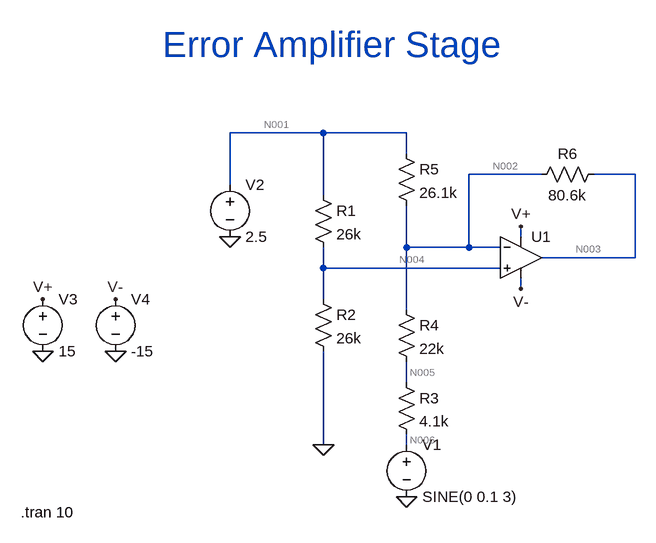
[diagram p0: schematic Error Amplifier Stage.asc]
Error Amplifier Stage.asc, the LTspice schematic file:
Version 4
SHEET 1 1000 680
WIRE -96 -16 -240 -16
WIRE 32 -16 -96 -16
WIRE 32 16 32 -16
WIRE 240 48 128 48
WIRE 384 48 320 48
WIRE -240 64 -240 -16
WIRE -96 80 -96 -16
WIRE 208 144 208 128
WIRE 32 160 32 96
WIRE 128 160 128 48
WIRE 128 160 32 160
WIRE 176 160 128 160
WIRE 384 176 384 48
WIRE 384 176 240 176
WIRE -96 192 -96 160
WIRE 176 192 -96 192
WIRE 208 224 208 208
WIRE -96 240 -96 192
WIRE 32 256 32 160
WIRE 32 368 32 336
WIRE -96 464 -96 320
WIRE 32 464 32 448
FLAG -240 144 0
FLAG 32 544 0
FLAG -96 464 0
FLAG -528 320 0
FLAG -416 320 0
FLAG 208 128 V+
FLAG 208 224 V-
FLAG -416 240 V-
FLAG -528 240 V+
SYMBOL OpAmps\\UniversalOpAmp 208 176 R0
SYMATTR InstName U1
SYMBOL voltage 32 448 R0
WINDOW 123 0 0 Left 0
WINDOW 39 0 0 Left 0
SYMATTR InstName V1
SYMATTR Value SINE(0 0.1 3)
SYMBOL voltage -240 48 R0
WINDOW 123 0 0 Left 0
WINDOW 39 0 0 Left 0
SYMATTR InstName V2
SYMATTR Value 2.5
SYMBOL voltage -528 224 R0
WINDOW 123 0 0 Left 0
WINDOW 39 0 0 Left 0
SYMATTR InstName V3
SYMATTR Value 15
SYMBOL voltage -416 224 R0
WINDOW 123 0 0 Left 0
WINDOW 39 0 0 Left 0
SYMATTR InstName V4
SYMATTR Value -15
SYMBOL res -112 64 R0
SYMATTR InstName R1
SYMATTR Value 26k
SYMBOL res -112 224 R0
SYMATTR InstName R2
SYMATTR Value 26k
SYMBOL res 16 352 R0
SYMATTR InstName R3
SYMATTR Value 4.1k
SYMBOL res 16 240 R0
SYMATTR InstName R4
SYMATTR Value 22k
SYMBOL res 16 0 R0
SYMATTR InstName R5
SYMATTR Value 26.1k
SYMBOL res 336 32 R90
WINDOW 0 0 56 VBottom 2
WINDOW 3 32 56 VTop 2
SYMATTR InstName R6
SYMATTR Value 80.6k
TEXT -562 568 Left 2 !.tran 10
TEXT -344 -152 Left 5 ;Error Amplifier Stage

The netlist it stands for:
* Error Amplifier Stage.asc
XU1 N004 N002 V+ V- N003 level1 Avol=1Meg GBW=10Meg Vos=0 En=0 Enk=0 In=0 Ink=0 Rin=500Meg  ; pins In+ In- V+ V- OUT
V1 N006 0 SINE(0 0.1 3)
V2 N001 0 2.5
V3 V+ 0 15
V4 V- 0 -15
R1 N001 N004 26k
R2 N004 0 26k
R3 N005 N006 4.1k
R4 N002 N005 22k
R5 N001 N002 26.1k
R6 N003 N002 80.6k
.tran 10
* Error Amplifier Stage
.lib UniversalOpAmp1.lib
.backanno
.end

* Results of the author's LTspice run, read from the files saved beside the schematic
* Operating Point, zero values left out:
*   V(n002) = 1.25 V
*   V(n004) = 1.25 V
*   V(n003) = 1.25 V
*   V(v+) = 15 V
*   V(v-) = -15 V
*   V(n001) = 2.5 V
*   V(n005) = 196.4 mV
*   I(R6) = -86.21 pA
*   I(R5) = 47.89 µA
*   I(R4) = 47.89 µA
*   I(R3) = 47.89 µA
*   I(R2) = 48.08 µA
*   I(R1) = 48.08 µA
*   I(V4) = 32.5 nA
*   I(V3) = -27.5 nA
*   I(V2) = -95.97 µA
*   I(V1) = 47.89 µA
*   Ix(u1:1) = 2.5 nA
*   Ix(u1:2) = 2.5 nA
*   Ix(u1:3) = 27.5 nA
*   Ix(u1:4) = -32.5 nA
*   Ix(u1:5) = 931.3 pA
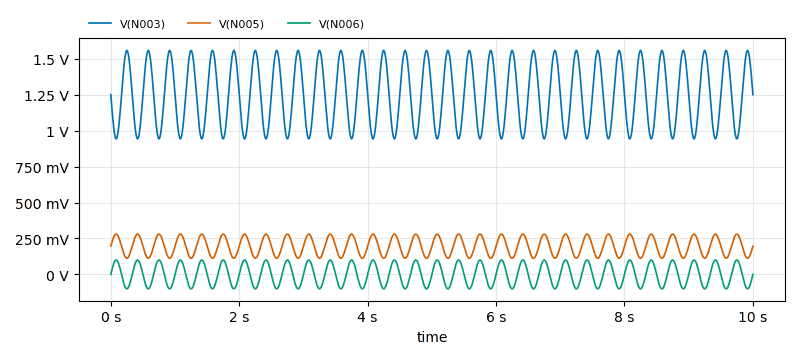
[diagram p1: Transient Analysis of Error Amplifier Stage.asc, plotted from the saved traces]
* Transient Analysis, 1 run:
*   V(N003): min 941.9 mV, max 1.558 V, average 1.25 V, rms 1.269 V, last 1.25 V
*   V(N005): min 112.3 mV, max 280.4 mV, average 196.4 mV, rms 205.1 mV, last 196.4 mV
*   V(N006): min -99.99 mV, max 100 mV, average 107 nV, rms 70.74 mV, last 0 V